# EAGLE design binary_clock_rev1 (EAGLE 5.11)
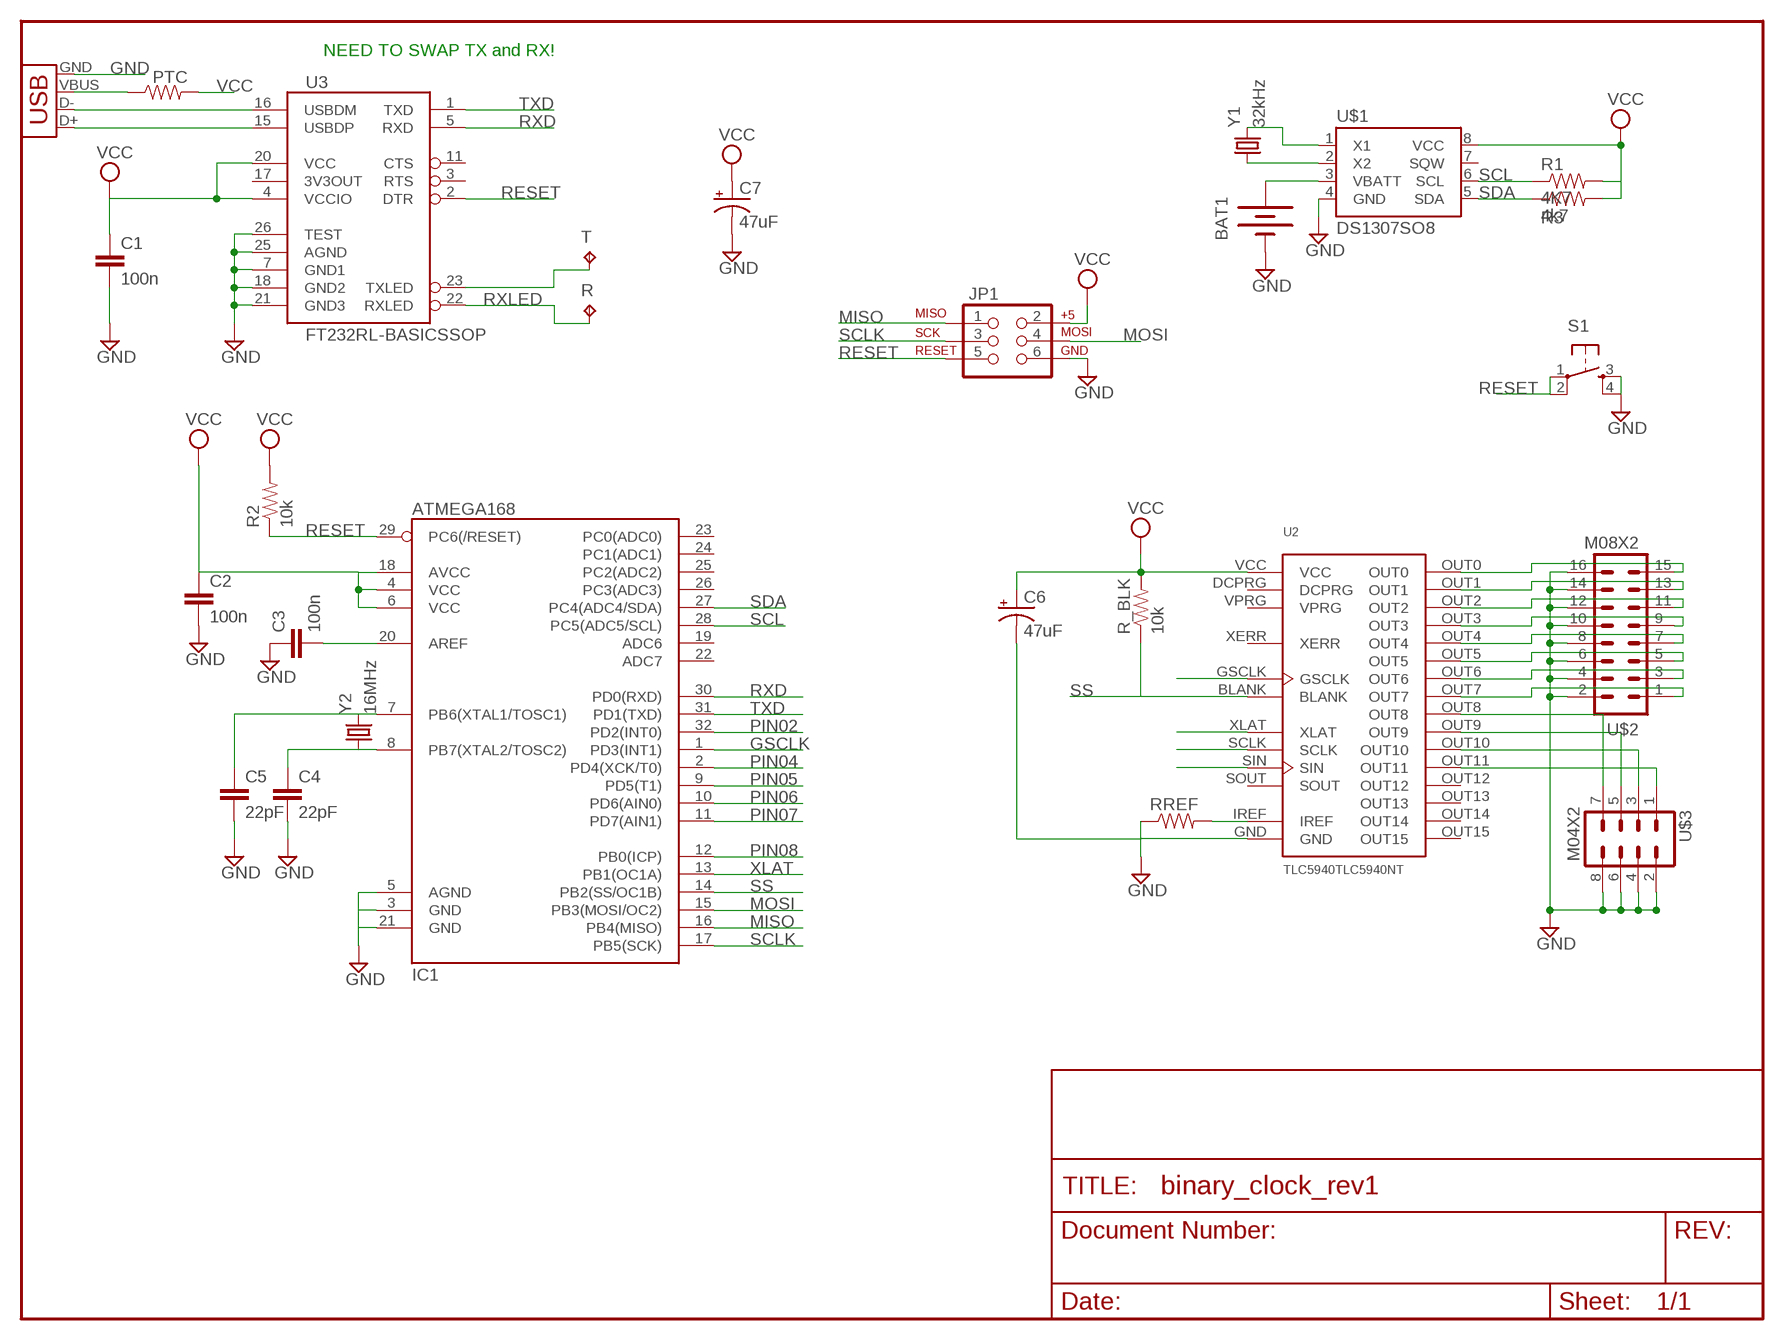
[diagram p0: schematic, sheet 1]

## Parts
BAT1  BATTERY12MM  [BATTCON_12MM]
C1  100n  CAP1206  [1206]
C2  100n  CAP1206  [1206]
C3  100n  CAP1206  [1206]
C4  22pF  CAP1206  [1206]
C5  22pF  CAP1206  [1206]
C6  47uF  CPOL-USD/7343-31W  [D/7343-31W]
C7  47uF  CPOL-USD/7343-31W  [D/7343-31W]
IC1  ATMEGA168  [TQFP32-08]
JP1  AVR_SPI_PRG_62X3_LOCK  [2X3_LOCK]
PTC  RESISTOR1206  [1206]
R  TPB1,27  [B1,27]
R1  4K7  RESISTOR1206  [1206]
R2  10k  RESISTOR1206  [1206]
R3  4k7  RESISTOR1206  [1206]
R_BLK  10k  RESISTOR1206  [1206]
RREF  2.2k  RESISTOR1206  [1206]
S1  TAC_SWITCHSMD  [TACTILE_SWITCH_SMD]
T  TPB1,27  [B1,27]
U2  TLC5940TLC5940NT  [DIL28-3]
U3  FT232RL-BASICSSOP  [SSOP28DB]
U$1  DS1307SO8  [SO08]
U$2  M08X2  [2X8]
U$3  M04X2  [2X4]
X1  USBSMD  [USB-MINIB]
Y1  32kHz  CRYSTAL32-SMD  [CRYSTAL-32KHZ-SMD]
Y2  16MHz  CRYSTALHC49US  [HC49US]

## Nets
GND: BAT1.GND(-) C1.2 C2.2 C3.1 C4.2 C5.2 C6.- C7.- IC1.3(GND) IC1.5(AGND) IC1.21(GND) JP1.6 RREF.1 S1.3 S1.4 U2.GND U3.7(GND1) U3.18(GND2) U3.21(GND3) U3.25(AGND) U3.26(TEST) U$1.4(GND) U$2.2 U$2.4 U$2.6 U$2.8 U$2.10 U$2.12 U$2.14 U$2.16 U$3.2 U$3.4 U$3.6 U$3.8 X1.GND
GSCLK: IC1.1(PD3(INT1)) U2.GSCLK
MISO: IC1.16(PB4(MISO)) JP1.1
MOSI: IC1.15(PB3(MOSI/OC2)) JP1.4 U2.SIN
N$1: U2.OUT7 U$2.1
N$2: U2.OUT6 U$2.3
N$3: U2.OUT5 U$2.5
N$4: U2.OUT4 U$2.7
N$5: U2.OUT3 U$2.9
N$6: U2.OUT2 U$2.11
N$7: U2.OUT1 U$2.13
N$8: U2.OUT0 U$2.15
N$9: U2.OUT8 U$3.7
N$10: U2.OUT9 U$3.5
N$11: U2.OUT10 U$3.3
N$12: U2.OUT11 U$3.1
N$13: BAT1.PWR@1(+) U$1.3(VBATT)
N$14: U3.15(USBDP) X1.D+
N$15: U3.16(USBDM) X1.D-
N$16: C3.2 IC1.20(AREF)
N$17: PTC.1 X1.VBUS
N$18: RREF.2 U2.IREF
N$19: U$1.1(X1) Y1.X2
N$20: U$1.2(X2) Y1.X1
N$21: C5.1 IC1.7(PB6(XTAL1/TOSC1)) Y2.2
N$22: C4.1 IC1.8(PB7(XTAL2/TOSC2)) Y2.1
PIN02: IC1.32(PD2(INT0))
PIN04: IC1.2(PD4(XCK/T0))
PIN05: IC1.9(PD5(T1))
PIN06: IC1.10(PD6(AIN0))
PIN07: IC1.11(PD7(AIN1))
PIN08: IC1.12(PB0(ICP))
RESET: IC1.29(PC6(/RESET)) JP1.5 R2.1 S1.1 S1.2 U3.2(DTR)
RXD: IC1.30(PD0(RXD)) U3.5(RXD)
RXLED: R.TP U3.22(RXLED)
SCL: IC1.28(PC5(ADC5/SCL)) R1.1 U$1.6(SCL)
SCLK: IC1.17(PB5(SCK)) JP1.3 U2.SCLK
SDA: IC1.27(PC4(ADC4/SDA)) R3.1 U$1.5(SDA)
SS: IC1.14(PB2(SS/OC1B)) R_BLK.1 U2.BLANK
TXD: IC1.31(PD1(TXD)) U3.1(TXD)
TXLED: T.TP U3.23(TXLED)
VCC: C1.1 C2.1 C6.+ C7.+ IC1.4(VCC) IC1.6(VCC) IC1.18(AVCC) JP1.2 PTC.2 R1.2 R2.2 R3.2 R_BLK.2 U2.VCC U3.4(VCCIO) U3.20(VCC) U$1.8(VCC)
XLAT: IC1.13(PB1(OC1A)) U2.XLAT
Unconnected: IC1.19(ADC6) IC1.22(ADC7) IC1.23(PC0(ADC0)) IC1.24(PC1(ADC1)) IC1.25(PC2(ADC2)) IC1.26(PC3(ADC3)) U2.DCPRG U2.OUT12 U2.OUT13 U2.OUT14 U2.OUT15 U2.SOUT U2.VPRG U2.XERR U3.3(RTS) U3.11(CTS) U3.17(3V3OUT) U$1.7(SQW)

## Notes on the sheet
- NEED TO SWAP TX and RX!

## Library data of the parts
BAT1 = SparkFun:BATTERY: Battery Holders Various common sizes : AA, AAA, 20mm coin cell and 12mm coin cell.
C1-C3 = SparkFun:CAP: Capacitor Standard 0603 ceramic capacitor, and 0.1" leaded capacitor.
C4 C5 = JitterLab:CAP: Capacitor Standard 0603 ceramic capacitor, and 0.1" leaded capacitor.
C6 C7 = rcl:CPOL-US: POLARIZED CAPACITOR, American symbol
IC1 = SparkFun:ATMEGA168
JP1 = SparkFun:AVR_SPI_PRG_6: AVR ISP 6 Pin This is the reduced ISP connector for AVR programming. Common on Arduino. This footprint will take up less PCB space and can be used with a 10-pin to 6-pin adapter such as SKU: BOB-08508
PTC R2 = SparkFun:RESISTOR: Resistor Basic schematic elements and footprints for 0603, 1206, and PTH resistors.
R T = testpad:TP: Test pad
R1 R3 R_BLK RREF = JitterLab:RESISTOR: Resistor Basic schematic elements and footprints for 0603, 1206, and PTH resistors.
S1 = SparkFun:TAC_SWITCH: Momentary Switch Button commonly used for reset or general input. Spark Fun Electronics SKU : COM-00097
U2 = TLC5940NT:TLC5940
U3 = SparkFun:FT232RL-BASIC: USB UART This is the simplified version of the FT232RL unit. Only what you need, nothing you don't. Spark Fun Electronics SKU : COM-00650
U$1 = SparkFun:DS1307
U$2 = SparkFun:M08X2
U$3 = SparkFun:M04X2
X1 = SparkFun:USB: USB Connectors USB-B-PTH is fully proven SKU : PRT-00139 USB-miniB is fully proven SKU : PRT-00587 USB-A-PCB is untested. USB-A-H is throughly reviewed, but untested. Spark Fun Electronics SKU : PRT-00437 USB-B-SMT is throughly reviewed, but untested. Needs silkscreen touching up. USB-A-S has not been used/tested USB-MB-H has not been used/tested
Y1 Y2 = SparkFun:CRYSTAL: Crystals Various standard crystals. Proven footprints. Spark Fun Electronics SKU : COM-00534

## Board
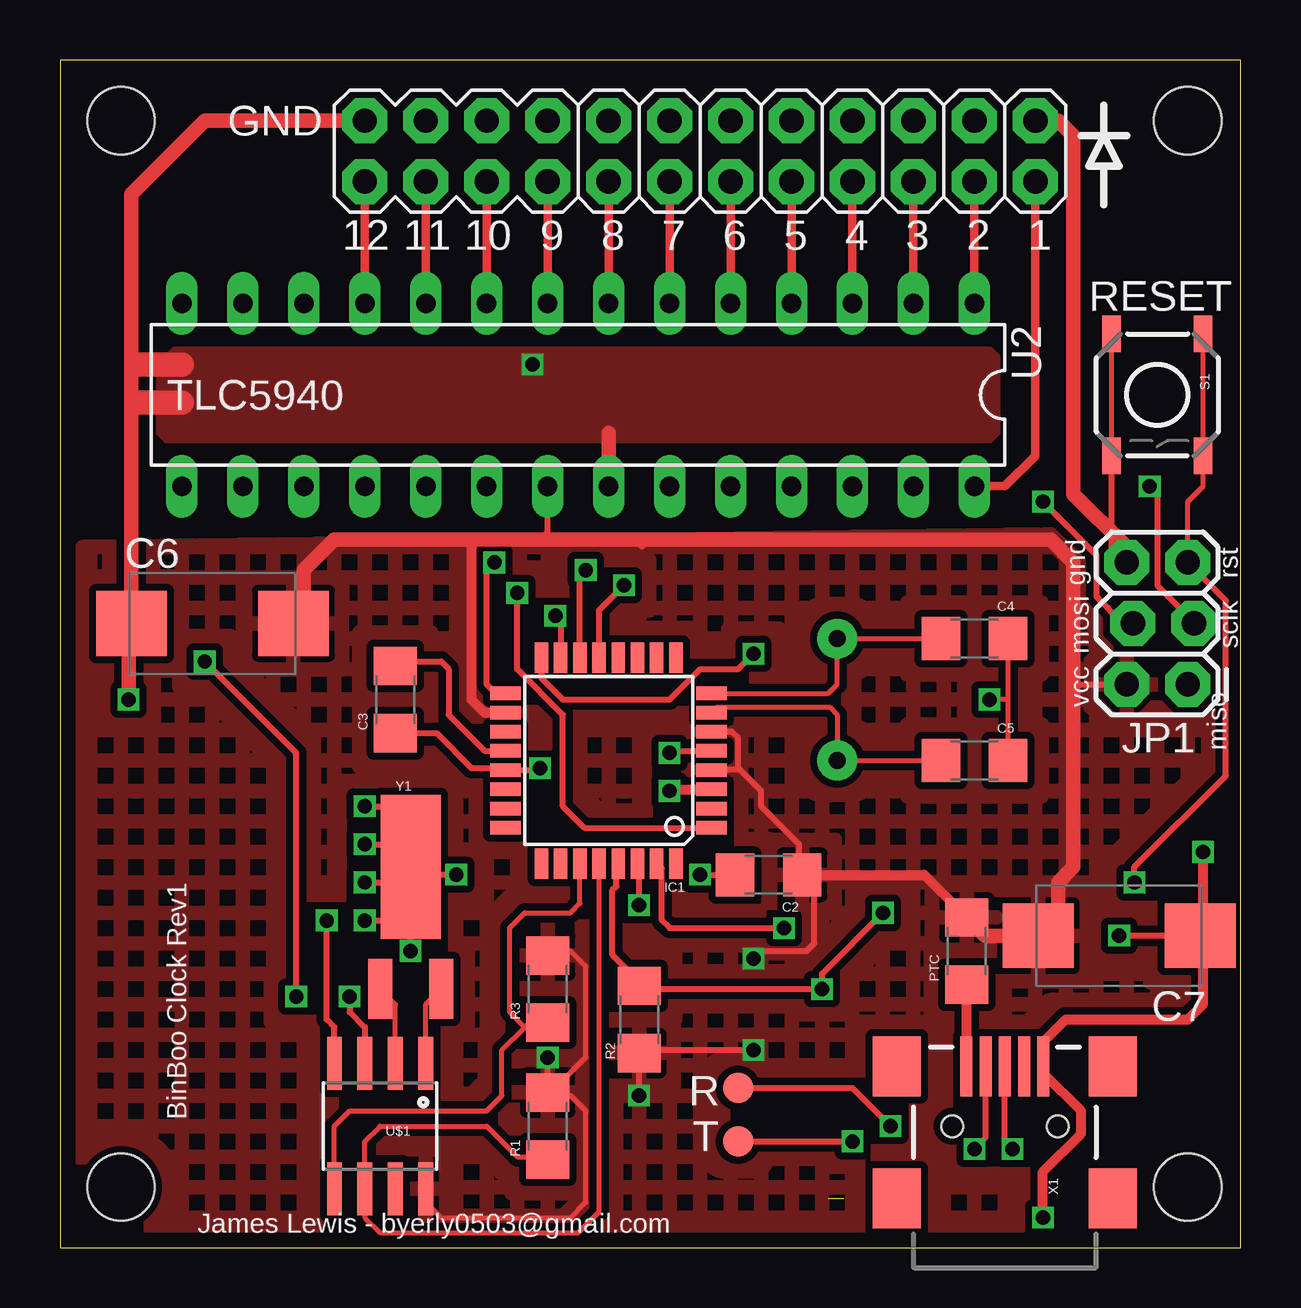
[diagram p1: board, top side]
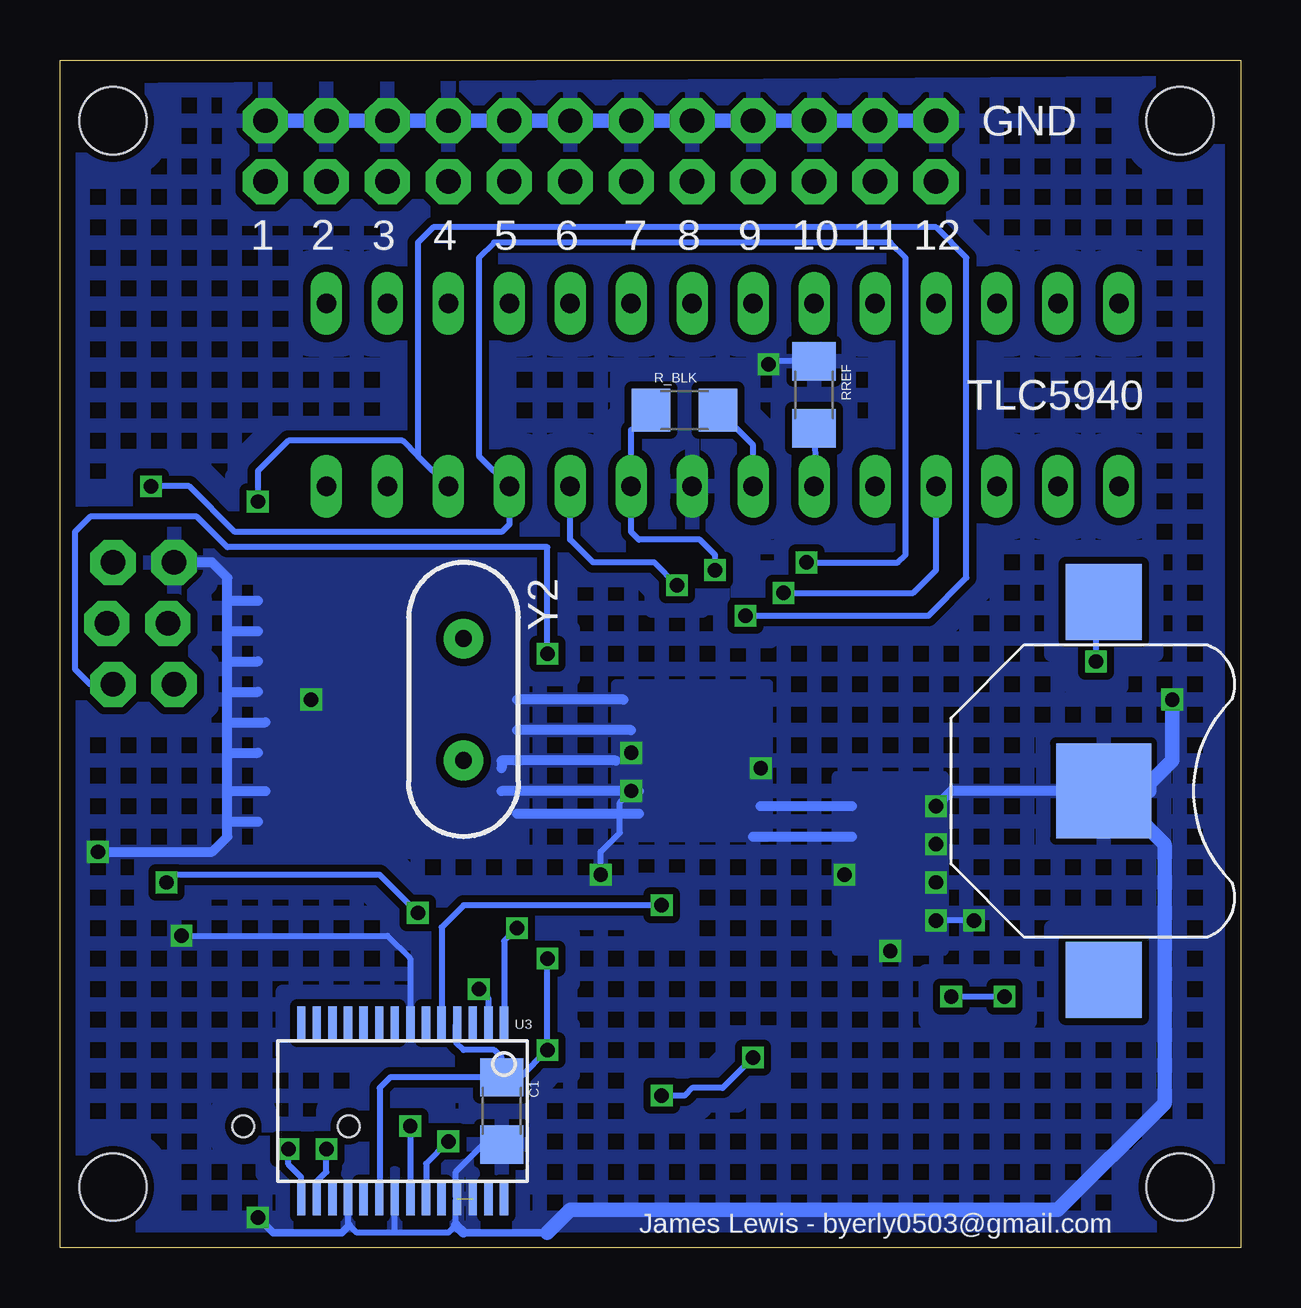
[diagram p2: board, bottom side, seen from below]

Size 49.2 x 49.52 mm. Coordinates in mm from the lower left corner, seen from the top.
Outline: 0,0 49.2,0 49.2,49.52 0,49.52 0,0
Copper layers (1*16): Top 0.035mm / dielectric 1.5mm / Bottom 0.035mm
Design rules "Fusion_eagle_rule_v1.1": minimum track width 6mil, minimum drill 12mil, track to track 6mil, track to pad 6mil, pad to pad 6mil, via to via 6mil, smd to smd 0mil, copper to edge 10mil, drill to drill 10mil, minimum pad ring 10mil, minimum via ring 6mil, stop-mask expansion 2mil, vias tented up to drill 100mil, thermal gap 10mil
Holes 2.8 mm at 46.99,46.99 46.99,2.54 2.54,2.54 2.54,46.99

### Footprints (pad centres in the part's own frame; a part is rotated, then mirrored left to right if it is on the bottom)
BATTCON_12MM = smd 3.962 x 3.962: GND 0,0 | smd 3.175 x 3.175: PWR@1 -7.874,0; PWR@2 7.874,0
1206 = smd 1.6 x 1.8: 1 -1.4,0; 2 1.4,0
D/7343-31W = smd 2.95 x 2.7: + 3.375,0; - -3.375,0
TQFP32-08 = smd 1.27 x 0.559: 1 -4.293,2.8; 2 -4.293,2; 3 -4.293,1.2; 4 -4.293,0.4; 5 -4.293,-0.4; 6 -4.293,-1.2; 7 -4.293,-2; 8 -4.293,-2.8; 17 4.293,-2.8; 18 4.293,-2; 19 4.293,-1.2; 20 4.293,-0.4; 21 4.293,0.4; 22 4.293,1.2; 23 4.293,2; 24 4.293,2.8 | smd 0.559 x 1.27: 9 -2.8,-4.293; 10 -2,-4.293; 11 -1.2,-4.293; 12 -0.4,-4.293; 13 0.4,-4.293; 14 1.2,-4.293; 15 2,-4.293; 16 2.8,-4.293; 25 2.8,4.293; 26 2,4.293; 27 1.2,4.293; 28 0.4,4.293; 29 -0.4,4.293; 30 -1.2,4.293; 31 -2,4.293; 32 -2.8,4.293
2X3_LOCK = drill 1.016 pad 1.88 octagon: 1 0,0; 2 0,2.54; 3 2.54,-0.254; 4 2.54,2.286; 5 5.08,0; 6 5.08,2.54
B1,27 = smd 1.27 x 1.27: TP 0,0
TACTILE_SWITCH_SMD = smd 1.524 x 0.762: 1 -2.54,1.905; 2 2.54,1.905; 3 -2.54,-1.905; 4 2.54,-1.905
DIL28-3 = drill 0.813 long: BLANK -3.81,3.81; DCPRG 6.35,3.81; GND -1.27,3.81; GSCLK 8.89,3.81; IREF 3.81,3.81; OUT0 -16.51,3.81; OUT1 -16.51,-3.81; OUT2 -13.97,-3.81; OUT3 -11.43,-3.81; OUT4 -8.89,-3.81; OUT5 -6.35,-3.81; OUT6 -3.81,-3.81; OUT7 -1.27,-3.81; OUT8 1.27,-3.81; OUT9 3.81,-3.81; OUT10 6.35,-3.81; OUT11 8.89,-3.81; OUT12 11.43,-3.81; OUT13 13.97,-3.81; OUT14 16.51,-3.81; OUT15 16.51,3.81; SCLK -8.89,3.81; SIN -11.43,3.81; SOUT 11.43,3.81; VCC 1.27,3.81; VPRG -13.97,3.81; XERR 13.97,3.81; XLAT -6.35,3.81
SSOP28DB = smd 0.348 x 1.397: 1 -4.225,-3.656; 2 -3.575,-3.656; 3 -2.925,-3.656; 4 -2.275,-3.656; 5 -1.625,-3.656; 6 -0.975,-3.656; 7 -0.325,-3.656; 8 0.325,-3.656; 9 0.975,-3.656; 10 1.625,-3.656; 11 2.275,-3.656; 12 2.925,-3.656; 13 3.575,-3.656; 14 4.225,-3.656; 15 4.225,3.656; 16 3.575,3.656; 17 2.925,3.656; 18 2.275,3.656; 19 1.625,3.656; 20 0.975,3.656; 21 0.325,3.656; 22 -0.325,3.656; 23 -0.975,3.656; 24 -1.625,3.656; 25 -2.275,3.656; 26 -2.925,3.656; 27 -3.575,3.656; 28 -4.225,3.656
SO08 = smd 0.61 x 2.21: 1 -1.905,-2.616; 2 -0.635,-2.616; 3 0.635,-2.616; 4 1.905,-2.616; 5 1.905,2.616; 6 0.635,2.616; 7 -0.635,2.616; 8 -1.905,2.616
2X8 = drill 1.016 pad 1.88 octagon: 1 0,0; 2 0,2.54; 3 2.54,0; 4 2.54,2.54; 5 5.08,0; 6 5.08,2.54; 7 7.62,0; 8 7.62,2.54; 9 10.16,0; 10 10.16,2.54; 11 12.7,0; 12 12.7,2.54; 13 15.24,0; 14 15.24,2.54; 15 17.78,0; 16 17.78,2.54
2X4 = drill 1.016 pad 1.88 octagon: 1 -3.81,-1.27; 2 -3.81,1.27; 3 -1.27,-1.27; 4 -1.27,1.27; 5 1.27,-1.27; 6 1.27,1.27; 7 3.81,-1.27; 8 3.81,1.27
USB-MINIB = smd 2.5 x 0.5: D+ 2.5,0; D- 2.5,0.8; GND 2.5,-1.6; ID 2.5,-0.8; VBUS 2.5,1.6 | smd 2.5 x 2: MTN1 -3,4.5; MTN2 2.5,4.5; MTN3 -3,-4.5; MTN4 2.5,-4.5 | hole 0.9: 0,2.2; 0,-2.2
CRYSTAL-32KHZ-SMD = smd 2.5 x 6: SHEILD 0,5.08 | smd 1 x 2.5: X1 -1.27,0; X2 1.27,0
HC49US = drill 0.7 pad 1.651 round: 1 -2.54,0; 2 2.54,0

### Placement (x,y rotation side)
BAT1  5.71,19.05 270 bottom
C1  30.8,5.71 270 bottom
C2  29.53,15.56 180 top
C3  13.97,22.86 90 top
C4  38.1,25.4 0 top
C5  38.1,20.32 0 top
C6  6.35,26.04 0 top
C7  44.13,13.02 180 top
IC1  22.86,20.32 180 top
JP1  46.99,23.5 90 top
PTC  37.78,12.38 90 top
R  28.26,6.67 0 top
R1  20.32,5.08 90 top
R2  24.13,9.53 270 top
R3  20.32,10.79 90 top
R_BLK  23.18,34.92 0 bottom
RREF  17.78,35.56 270 bottom
S1  45.72,35.56 270 top
T  28.26,4.45 0 top
U2  21.59,35.56 180 top
U3  34.92,5.71 180 bottom
U$1  13.34,5.08 180 top
U$2  22.86,44.45 0 top
U$3  16.51,45.72 0 top
X1  39.37,5.08 90 top
Y1  14.61,10.79 0 top
Y2  32.38,22.86 270 bottom

### Tracks (layer width: path | path; a pad name or v marks a point on that pad's centre or on a via)
GND  (via drill 0.6)  (1 unrouted)
  Top 0.203: C5.2 39.5,22.86 | 39.5,22.86 C4.2 | 39.5,22.86 v38.73,22.86 | S1.4 S1.3
  Top 0.254: C7.- v44.13,13.02 | v12.7,18.41 14.29,18.41 | v12.7,16.83 13.97,16.83 | v12.7,15.24 13.97,15.24 | v12.7,13.65 13.97,13.65 | v14.61,12.38 14.61,13.34 | U$1.4 11.43,9.21 11.11,9.53 v11.11,13.65 | v20,20 19.92,19.92 IC1.21 18.48,20 17.14,20 15.69,21.46 C3.1 | v25.4,19.05 25.56,18.89 | v26.67,15.56 C2.2 | IC1.5 25.48,20.72 v25.4,20.64 | S1.4 43.81,29.21 JP1.6 | v19.68,36.83 20,36.83 | 2.98,43.93 2.98,35.44 3.17,35.24
  Top 0.406: v47.62,16.51 47.62,13.13 C7.- 47.62,12.9 47.62,10.16 46.99,9.53 41.91,9.53 40.97,8.59 X1.GND 40.97,7.29 42.55,5.71 42.55,4.76 40.96,3.17 v40.96,1.27 | IC1.3 25.47,19.12 v25.4,19.05
  Top 0.61: 13.34,46.99 U$3.2 6.03,46.99 2.98,43.93 C6.- | JP1.6 44.45,29.21 42.23,31.43 42.23,46.35 41.59,46.99 U$2.16 | U2.GND 22.86,33.97 | v2.86,22.86 2.86,26.35
  Top 1.016: 3.17,36.83 5.08,36.83 | 3.17,35.24 5.08,35.24
  Bottom 0.254: U3.18 37.2,1 37.15,0.95 36.83,0.64 35.24,0.64 | 35.24,0.64 33.02,0.64 32.7,0.95 32.7,2.01 U3.25 32.7,2.11 32.7,3.17 31.56,4.32 C1.2 | U3.21 35.25,0.64 35.24,0.64 | v44.13,13.02 35.56,13.02 34.61,12.06 U3.7 | v11.11,13.65 v12.7,13.65 | v20,20 20.32,20 | v26.67,15.56 26.67,16.51 25.88,17.3 25.88,18.57 v25.4,19.05 | 25.08,20.64 v25.4,20.64 | RREF.1 19.55,36.96 v19.68,36.83
  Bottom 0.305: v40.96,1.27 40.32,0.64 37.47,0.64 37.15,0.95 | 28.89,0.64 32.38,0.64
  Bottom 0.406: v12.7,18.41 12.06,19.05 BAT1.GND 3.81,19.05 | 32.38,0.64 32.7,0.95 | 26.04,20.32 30.8,20.32 30.8,20 | 30.8,19.05 v25.4,19.05 25.08,19.05 | 16.19,18.41 20,18.41 | 16.19,17.14 20.32,17.14 | JP1.6 42.86,28.57 42.23,27.94 42.23,26.99 | 42.23,17.78 42.23,17.14 42.86,16.51 v47.62,16.51 | 42.23,17.78 42.23,19.05 | 42.23,19.05 42.23,20.64 | 42.23,20.64 42.23,21.91 | 42.23,21.91 42.23,23.18 | 42.23,23.18 42.23,24.45 | 42.23,24.45 42.23,25.72 | 42.23,25.72 42.23,26.99 | 42.23,17.78 40.96,17.78 | 42.23,19.05 40.64,19.05 | 42.23,20.64 40.96,20.64 | 42.23,21.91 40.64,21.91 | 42.23,23.18 40.96,23.18 | 42.23,24.45 40.96,24.45 | 42.23,25.72 40.96,25.72 | 42.23,26.99 40.96,26.99 | 25.72,22.86 30.16,22.86 | 25.4,21.59 30.16,21.59 | 25.08,18.1 30.16,18.1
  Bottom 0.61: U$2.16 U$2.14 U$2.12 U$2.10 U$2.8 U$2.6 U$2.4 U$2.2 U$3.8 U$3.6 U$3.4 U$3.2 | 3.81,19.05 3.81,19.37 2.86,20.32 v2.86,22.86 | BAT1.GND 5.4,19.05 3.17,16.83 3.17,6.03 7.62,1.59 27.94,1.59 28.89,0.64
  other vias: 16.51,15.56
  pour Bottom (isolate 0.305): 19.68,23.5 26.04,23.5 26.04,17.14 19.68,17.14
  pour Bottom (isolate 0.305): 12.38,12.38 16.83,12.38 16.83,19.68 12.38,19.68
  pour Bottom (isolate 0.305): 30.8,28.57 40.96,28.57 40.96,16.83 29.84,16.83 29.84,28.57
  pour Top (isolate 0.305): 4.76,37.47 38.73,37.47 39.05,37.15 39.05,33.97 38.73,33.66 4.45,33.66 4.13,33.97 4.13,36.83
  pour Bottom (isolate 0.305, hatched): 0.95,48.58 48.26,48.26 48.26,0.95 0.95,0.95
GSCLK  (via drill 0.6)
  Top 0.254: IC1.1 21.85,17.52 20.95,18.41 20.95,22.23 19.05,24.13 v19.05,27.3
  Bottom 0.254: v19.05,27.3 13.65,27.3 12.7,28.26 U2.GSCLK
MISO  (via drill 0.6)
  Top 0.254: IC1.16 20.06,23.75 20.95,22.86 25.4,22.86 26.67,24.13 28.26,24.13 v28.89,24.77
  Bottom 0.254: v28.89,24.77 28.89,29.21 42.23,29.21 43.5,30.48 47.94,30.48 48.58,29.84 48.58,24.13 47.94,23.5 JP1.1
MOSI  (via drill 0.6)
  Top 0.254: IC1.15 20.86,26.13 v20.64,26.35 | JP1.4 44.29,26.04 43.18,27.15 43.18,28.89 v40.96,31.11
  Bottom 0.254: v20.64,26.35 13.02,26.35 11.43,27.94 11.43,41.27 12.7,42.55 33.66,42.55 34.29,41.91 34.29,33.02 | 34.29,33.02 U2.SIN | v40.96,31.11 40.96,32.38 39.69,33.66 34.92,33.66 34.29,33.02
N$1
  Top 0.35: U2.OUT7 U$2.1
N$2
  Top 0.35: U2.OUT6 U$2.3
N$3
  Top 0.35: U2.OUT5 U$2.5
N$4
  Top 0.35: 30.71,44.22 30.48,44.22 U2.OUT4
  Top 0.406: 30.71,44.22 U$2.7
N$5
  Top 0.35: U2.OUT3 U$2.9
N$6
  Top 0.35: U2.OUT2 U$2.11
N$7
  Top 0.35: U2.OUT1 U$2.13
N$8
  Top 0.35: U2.OUT0 39.37,31.75 40.64,33.02 U$2.15
N$9
  Top 0.35: U2.OUT8 U$3.7
N$10
  Top 0.35: U2.OUT9 U$3.5
N$11
  Top 0.35: U2.OUT10 U$3.3
N$12
  Top 0.35: U2.OUT11 U$3.1
N$13  (via drill 0.6)
  Top 0.254: U$1.3 12.7,9.21 12.06,9.84 v12.06,10.48 | v9.84,10.48 9.84,20.64 v6.03,24.45
  Bottom 0.254: v6.03,24.45 6.03,26.61 BAT1.PWR@1 | v9.84,10.48 v12.06,10.48
N$14  (via drill 0.6)
  Top 0.254: X1.D+ 39.37,4.45 v39.69,4.13
  Bottom 0.254: U3.15 39.15,2.96 39.69,3.49 v39.69,4.13
N$15  (via drill 0.6)
  Top 0.254: X1.D- 38.57,4.6 v38.1,4.13
  Bottom 0.254: U3.16 38.5,2.77 38.1,3.17 v38.1,4.13
N$16
  Top 0.254: IC1.20 17.7,20.72 16.19,22.23 16.19,24.13 15.88,24.45 14.16,24.45 C3.2
N$17
  Top 0.406: PTC.1 37.78,7.59 X1.VBUS
N$18
  Bottom 0.254: RREF.2 17.65,31.88 U2.IREF
N$19
  Top 0.203: U$1.1 15.24,10.16 Y1.X2
N$20
  Top 0.203: U$1.2 13.97,10.16 Y1.X1
N$21
  Top 0.203: IC1.7 27.38,22.54 32.07,22.54 32.38,22.23 Y2.2 C5.1
N$22
  Top 0.203: IC1.8 32.01,23.12 32.38,23.5 Y2.1 C4.1
N$34
  Top 0.254: 16.19,15.56 15.56,15.56
RESET  (via drill 0.6)
  Top 0.203: JP1.5 46.99,31.11 47.62,31.75 S1.2 S1.1
  Top 0.254: IC1.29 23.18,15.95 23.18,15.08 23.02,14.92 23.02,12.22 24.13,11.11 R2.1 24.26,10.79 v31.75,10.79 31.75,11.43 v34.29,13.97 | v44.77,15.24 44.77,15.88 48.58,19.68 48.58,26.99 JP1.5
  Bottom 0.254: U3.2 31.35,10.39 v31.75,10.79 | v34.29,13.97 35.88,15.56 44.45,15.56 v44.77,15.24
RXD  (via drill 0.6)
  Top 0.254: v24.13,14.29 24.13,15.96 IC1.30
  Bottom 0.254: U3.5 33.3,13.37 32.38,14.29 v24.13,14.29
RXLED  (via drill 0.6)
  Top 0.254: R.TP 33.02,6.67 v34.61,5.08
  Bottom 0.254: v34.61,5.08 U3.22
SCL
  Top 0.203: R1.1 20.19,3.81 19.05,3.81 17.78,5.08 13.34,5.08 12.7,4.45 U$1.6 12.7,1.27 13.34,0.64 21.59,0.64 22.46,1.5 IC1.28
SCLK  (via drill 0.6)
  Top 0.254: IC1.17 18.16,23.12 17.78,23.5 17.78,28.26 v18.1,28.57 | JP1.3 47.24,26.1 45.72,27.62 45.72,31.43 v45.4,31.75
  Bottom 0.254: v18.1,28.57 14.29,28.57 13.97,28.89 13.97,41.27 14.61,41.91 31.11,41.91 31.75,41.27 31.75,33.02 U2.SCLK 30.48,30.16 30.8,29.84 41.91,29.84 43.81,31.75 v45.4,31.75
SDA
  Top 0.203: U$1.5 11.43,5.08 12.06,5.71 17.78,5.71 18.41,6.35 18.41,8.26 19.37,9.21 | 19.37,9.21 19.68,9.53 20.19,9.53 R3.1 | IC1.27 21.66,14.36 21.27,13.97 19.37,13.97 18.73,13.34 18.73,9.84 19.37,9.21
SS  (via drill 0.6)
  Top 0.254: IC1.14 21.66,28.01 v21.91,28.26
  Bottom 0.254: v21.91,28.26 21.91,28.89 22.54,29.53 25.08,29.53 25.4,29.84 U2.BLANK 25.4,34.1 R_BLK.1
TXD  (via drill 0.6)
  Top 0.254: v30.16,13.34 25.4,13.34 25.08,13.65 25.08,15.8 IC1.31
  Bottom 0.254: U3.1 30.7,12.8 v30.16,13.34
TXLED  (via drill 0.6)
  Top 0.254: T.TP v33.02,4.45
  Bottom 0.254: U3.23 33.95,3.52 v33.02,4.45
VCC  (via drill 0.6)
  Top 0.203: U$1.8 15.24,1.91 15.88,1.27 21.27,1.27 21.91,1.91 21.91,5.71 21.27,6.35 20.45,6.35 R1.2 20.45,6.48 21.91,7.94 21.91,11.75 21.27,12.38 20.51,12.38 R3.2
  Top 0.254: v28.89,8.26 24.26,8.26 R2.2 v24.13,6.35 | R1.2 v20.32,7.94 | v28.89,12.06 29.21,12.38 31.11,12.38 31.43,12.7 31.43,15.56 | C7.+ 41.59,13.02 | 28.34,19.92 IC1.4 | 28.34,19.92 29.21,19.05 29.21,18.41 30.8,16.83 30.8,15.69 C2.1 | IC1.6 28.01,21.52 28.26,21.27 28.26,20 28.34,19.92 | U2.VCC 20.32,29.84 20,29.53 | 42.23,23.5 JP1.2
  Top 0.406: 24.45,29.53 24.26,29.34 | IC1.18 17.68,22.32 17.14,22.86 17.14,29.53 | C2.1 31.43,15.56 36.01,15.56 PTC.2
  Top 0.61: C7.+ 38.55,13.02 PTC.2 | 41.59,13.02 41.59,15.24 42.23,15.88 42.23,23.5 42.23,28.57 41.27,29.53 24.45,29.53 20,29.53 17.14,29.53 11.43,29.53 10.16,28.26 10.16,26.47 C6.+
  Bottom 0.254: C1.1 35.43,7.12 35.88,6.67 35.88,2.08 U3.20 | C1.1 30.03,7.12 v28.89,8.26 v28.89,12.06 | v24.13,6.35 23.18,6.35 22.86,6.67 21.59,6.67 v20.32,7.94 | C1.1 30.8,7.94 31.11,8.26 32.38,8.26 32.7,8.57 32.7,9.32 U3.4 | U2.VCC 20.32,33.47 R_BLK.2
  pour Top (isolate 0.305, hatched): 0.95,29.21 48.9,29.84 48.26,0.95 0.95,0.95
XLAT  (via drill 0.6)
  Top 0.254: IC1.13 22.46,26.59 v23.5,27.62
  Bottom 0.254: v23.5,27.62 24.45,28.57 26.99,28.57 27.94,29.53 U2.XLAT

### Text on the board
tPlace: GND
tNames: 12 | 11 | 10 | 9 | 8 | 7 | 6 | 5 | 4 | 3 | 2 | 1 | RESET | TLC5940 | rst | gnd | sclk | mosi | vcc | miso | BinBoo Clock Rev1 | James Lewis - byerly0503@gmail.com
bNames: GND | 12 | 11 | 10 | 9 | 8 | 7 | 6 | 5 | 4 | 3 | 2 | 1 | TLC5940 | James Lewis - byerly0503@gmail.com